# EAGLE design srfnec-pcb (EAGLE 6.5.0)
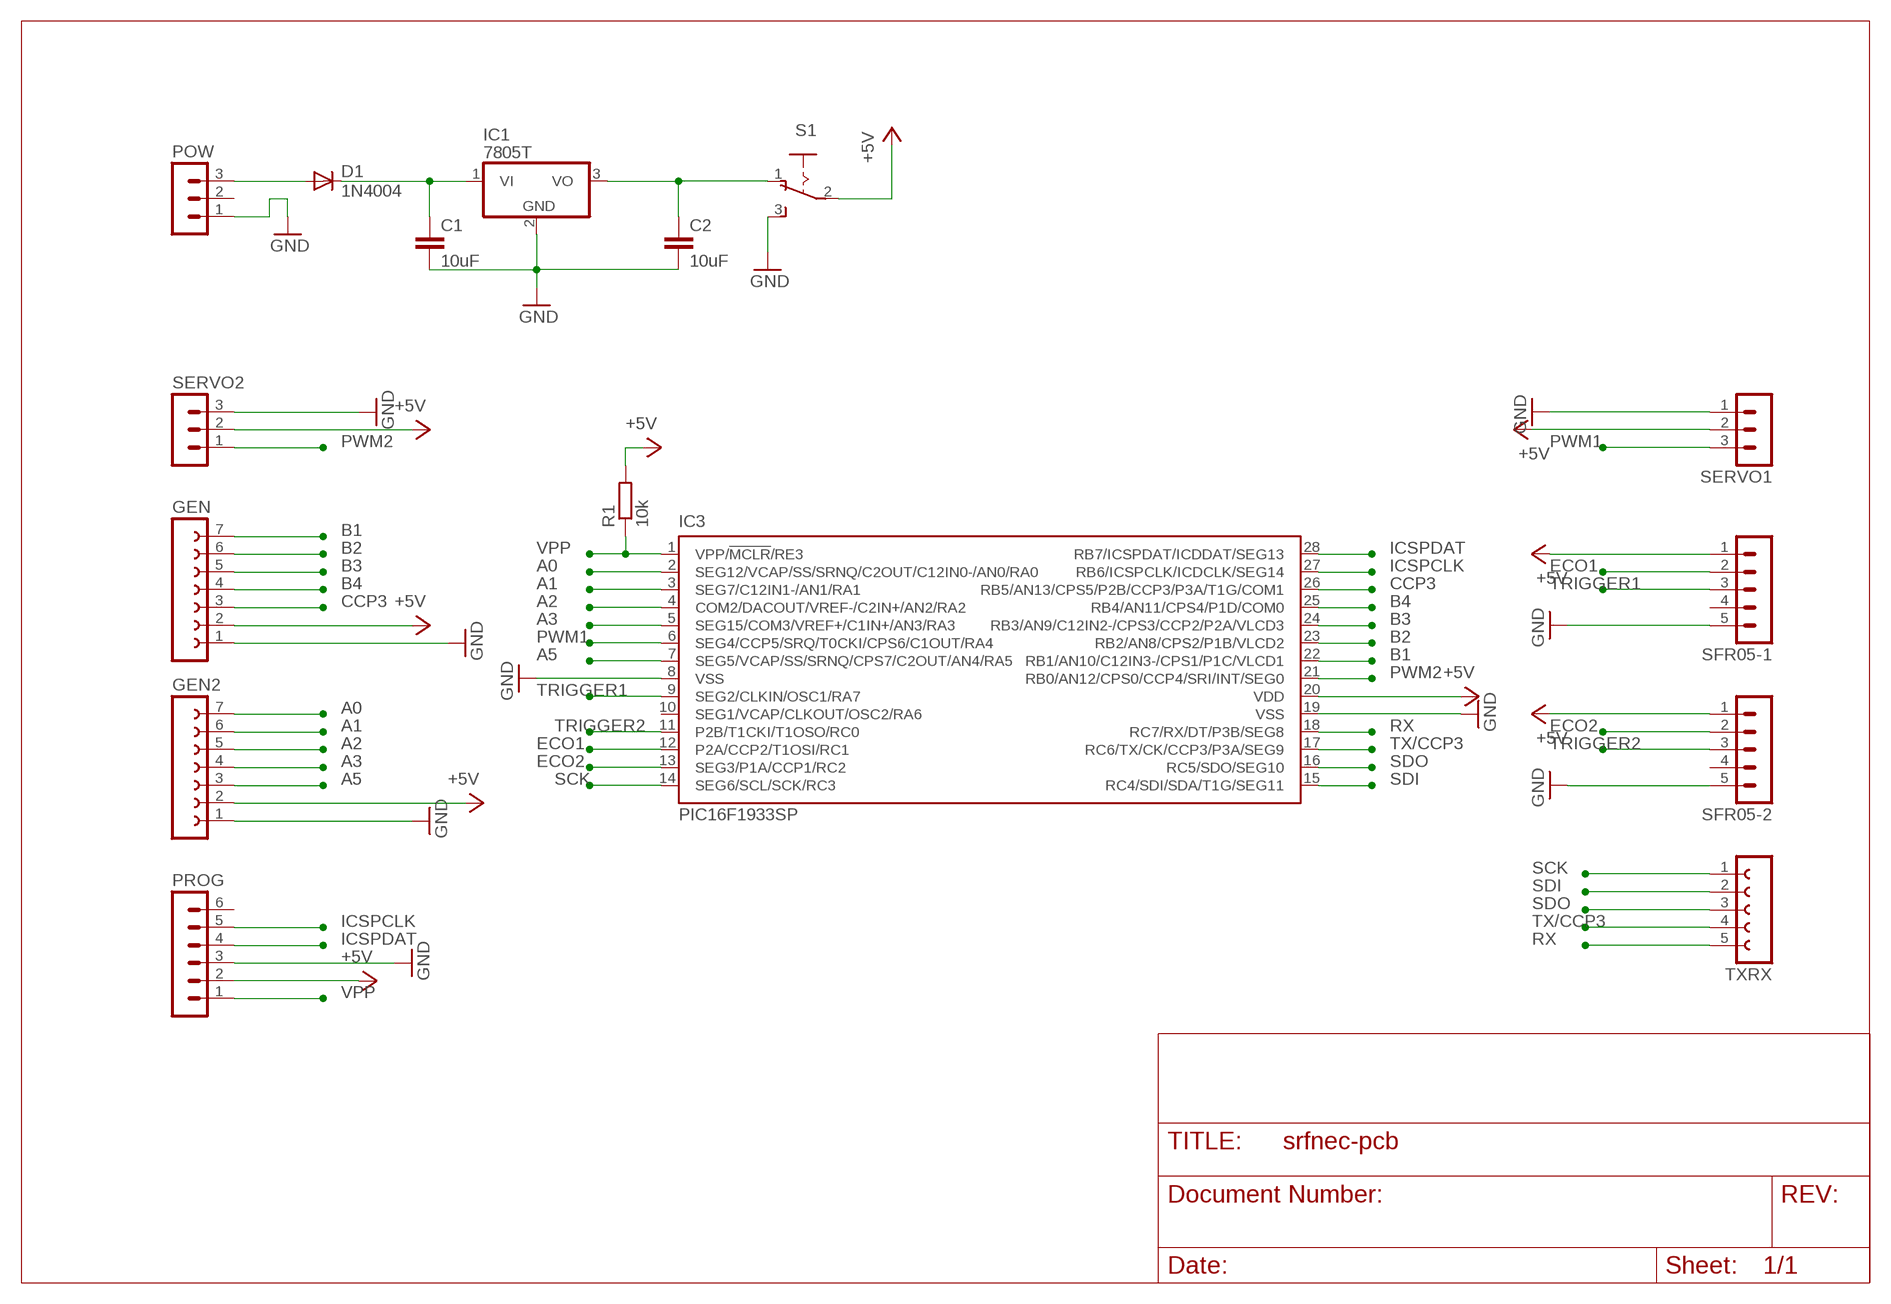
[diagram p0: schematic, sheet 1]

## Parts
C1  10uF  C5/2.5  [C5B2.5]
C2  10uF  C5/2.5  [C5B2.5]
D1  1N4004  [DO41-10]
GEN  FE07-1  [FE07]
GEN2  FE07-1  [FE07]
IC1  7805T  [TO220H]
IC3  PIC16F1933SP  [DIL28-3]
POW  MA03-1  [MA03-1]
PROG  MA06-1  [MA06-1]
R1  10k  R-EU_0204/7  [0204/7]
S1  255SB  [255SB]
SERVO1  MA03-1  [MA03-1]
SERVO2  MA03-1  [MA03-1]
SFR05-1  MA05-1  [MA05-1]
SFR05-2  MA05-1  [MA05-1]
TXRX  FE05-1  [FE05-1]

## Nets
+5V: GEN2.2 GEN.2 IC3.20(VDD) PROG.2 R1.2 S1.2(P) SERVO1.2 SERVO2.2 SFR05-1.1 SFR05-2.1
A0: GEN2.7 IC3.2(SEG12/VCAP/SS/SRNQ/C2OUT/C12IN0-/AN0/RA0)
A1: GEN2.6 IC3.3(SEG7/C12IN1-/AN1/RA1)
A2: GEN2.5 IC3.4(COM2/DACOUT/VREF-/C2IN+/AN2/RA2)
A3: GEN2.4 IC3.5(SEG15/COM3/VREF+/C1IN+/AN3/RA3)
A5: GEN2.3 IC3.7(SEG5/VCAP/SS/SRNQ/CPS7/C2OUT/AN4/RA5)
B1: GEN.7 IC3.22(RB1/AN10/C12IN3-/CPS1/P1C/VLCD1)
B2: GEN.6 IC3.23(RB2/AN8/CPS2/P1B/VLCD2)
B3: GEN.5 IC3.24(RB3/AN9/C12IN2-/CPS3/CCP2/P2A/VLCD3)
B4: GEN.4 IC3.25(RB4/AN11/CPS4/P1D/COM0)
CCP3: GEN.3 IC3.26(RB5/AN13/CPS5/P2B/CCP3/P3A/T1G/COM1)
ECO1: IC3.12(P2A/CCP2/T1OSI/RC1) SFR05-1.2
ECO2: IC3.13(SEG3/P1A/CCP1/RC2) SFR05-2.2
GND: C1.2 C2.2 GEN2.1 GEN.1 IC1.2(GND) IC3.8(VSS) IC3.19(VSS) POW.1 PROG.3 S1.3(S) SERVO1.1 SERVO2.3 SFR05-1.5 SFR05-2.5
ICSPCLK: IC3.27(RB6/ICSPCLK/ICDCLK/SEG14) PROG.5
ICSPDAT: IC3.28(RB7/ICSPDAT/ICDDAT/SEG13) PROG.4
N$1: C1.1 D1.C IC1.1(VI)
N$2: D1.A POW.3
N$3: C2.1 IC1.3(VO) S1.1(O)
PWM1: IC3.6(SEG4/CCP5/SRQ/T0CKI/CPS6/C1OUT/RA4) SERVO1.3
PWM2: IC3.21(RB0/AN12/CPS0/CCP4/SRI/INT/SEG0) SERVO2.1
RX: IC3.18(RC7/RX/DT/P3B/SEG8) TXRX.5
SCK: IC3.14(SEG6/SCL/SCK/RC3) TXRX.1
SDI: IC3.15(RC4/SDI/SDA/T1G/SEG11) TXRX.2
SDO: IC3.16(RC5/SDO/SEG10) TXRX.3
TRIGGER1: IC3.9(SEG2/CLKIN/OSC1/RA7) SFR05-1.3
TRIGGER2: IC3.11(P2B/T1CKI/T1OSO/RC0) SFR05-2.3
TX/CCP3: IC3.17(RC6/TX/CK/CCP3/P3A/SEG9) TXRX.4
VPP: IC3.1(VPP/!MCLR!/RE3) PROG.1 R1.1
Unconnected: IC3.10(SEG1/VCAP/CLKOUT/OSC2/RA6) POW.2 PROG.6 SFR05-1.4 SFR05-2.4

## Library data of the parts
C1 C2 = capacitor-wima:C: CAPACITOR naming: grid - package width
D1 = diode:1N4004: DIODE general purpose rectifier, 1 A
GEN GEN2 = con-lsta:FE07-1: FEMALE HEADER; OC_FARNELL: unknown; OC_NEWARK: unknown
IC1 = linear:78*: Positive VOLTAGE REGULATOR Source: http://cache.national.com/ds/LM/LM78L05.pdf http://www.fairchildsemi.com/ds/LM/LM7805.pdf
IC3 = microchip:PIC16F19*: Flash-Based, 8-Bit CMOS Microcontrollers wtih LCD Driver and nanoWatt XLP Technology Auto generated by make-symbol-device-package-bsdl.ulp Rev. 33 Source: http://ww1.microchip.com/downloads/en/DeviceDoc/41364D.pdf; MPN: PIC16F1933-I/SP; OC_FARNELL: 1755814; OC_NEWARK: 08R1938
POW SERVO1 SERVO2 = con-lstb:MA03-1: PIN HEADER; OC_FARNELL: unknown; OC_NEWARK: unknown
PROG = con-lstb:MA06-1: PIN HEADER; OC_FARNELL: unknown; OC_NEWARK: unknown
R1 = resistor:R-EU_: RESISTOR, European symbol
S1 = switch:255SB: SLIDING SWITCH Distributor Buerklin, 11G810
SFR05-1 SFR05-2 = con-lstb:MA05-1: PIN HEADER; OC_FARNELL: unknown; OC_NEWARK: unknown
TXRX = con-lsta:FE05-1: FEMALE HEADER; OC_FARNELL: unknown; OC_NEWARK: unknown

## Net classes
0 default: width 1.016 mm

## Board
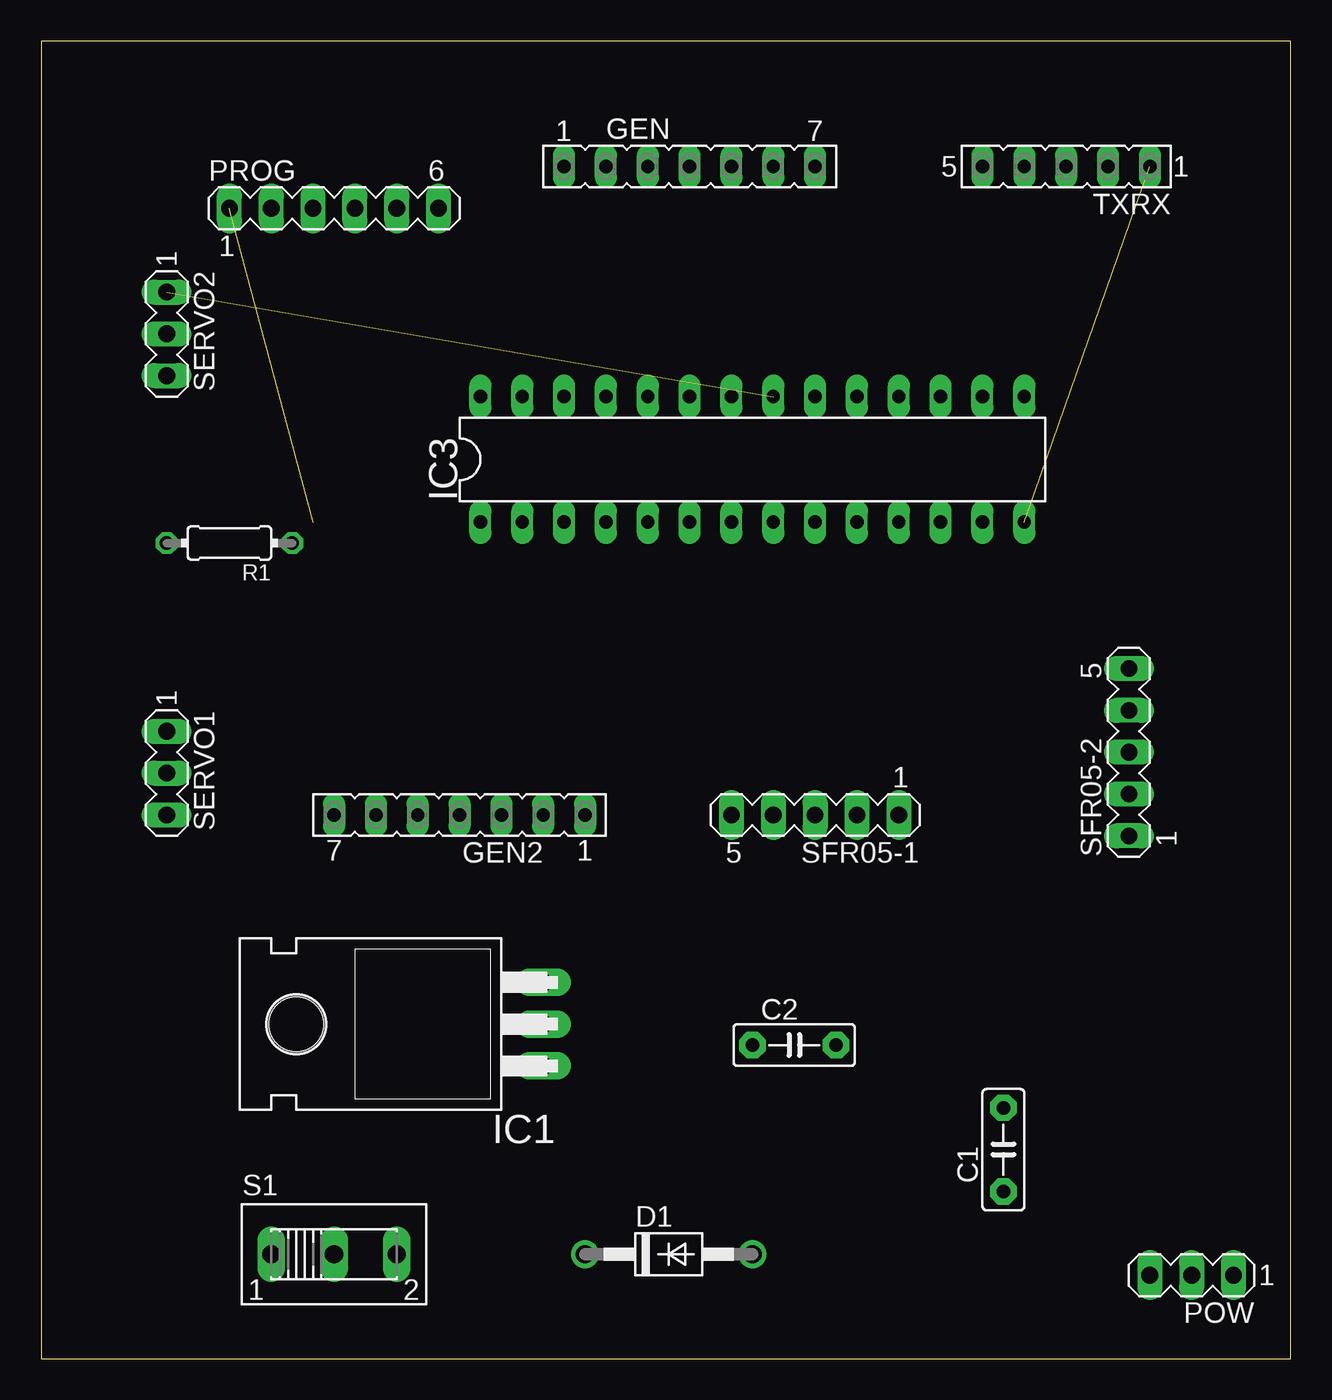
[diagram p1: board, top side]
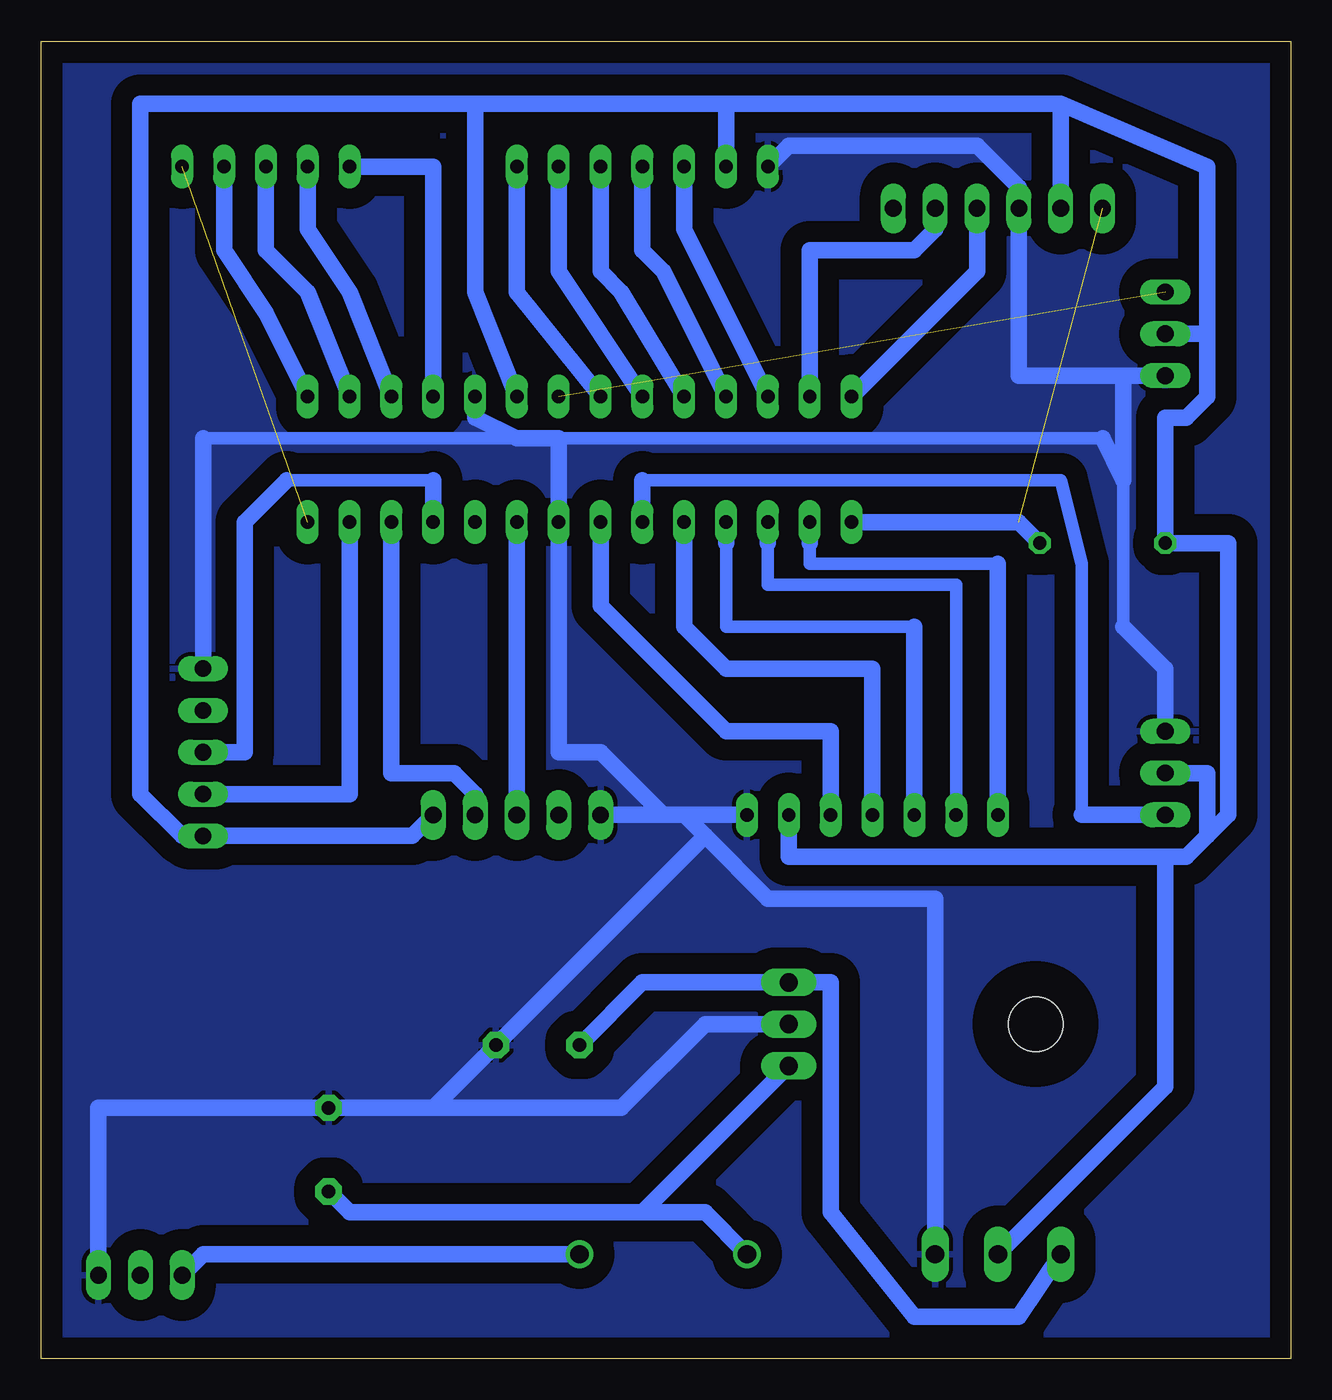
[diagram p2: board, bottom side, seen from below]

Size 75.87 x 80 mm. Coordinates in mm from the lower left corner, seen from the top.
Outline: 0,0 75.87,0 75.87,80 0,80 0,0
Copper layers (1*16): Top 0.035mm / dielectric 1.5mm / Bottom 0.035mm
Design rules "default": minimum track width 10mil, minimum drill 24mil, track to track 8mil, track to pad 8mil, pad to pad 8mil, via to via 8mil, smd to smd 8mil, copper to edge 40mil, drill to drill 8mil, minimum pad ring 10mil, minimum via ring 8mil, stop-mask expansion 4mil, vias tented up to drill 0mil, thermal gap 10mil

### Footprints (pad centres in the part's own frame; a part is rotated, then mirrored left to right if it is on the bottom)
C5B2.5 = drill 0.813 pad 1.6 octagon: 1 -2.54,0; 2 2.54,0
DO41-10 = drill 1.118: A 5.08,0; C -5.08,0
FE07 = drill 0.813 long: 1 -7.62,0; 2 -5.08,0; 3 -2.54,0; 4 0,0; 5 2.54,0; 6 5.08,0; 7 7.62,0
TO220H = drill 1.118 long: 1 -2.54,-10.16; 2 0,-10.16; 3 2.54,-10.16 | hole 3.302: 0,4.826
DIL28-3 = drill 0.813 long: 1 -16.51,-3.81; 2 -13.97,-3.81; 3 -11.43,-3.81; 4 -8.89,-3.81; 5 -6.35,-3.81; 6 -3.81,-3.81; 7 -1.27,-3.81; 8 1.27,-3.81; 9 3.81,-3.81; 10 6.35,-3.81; 11 8.89,-3.81; 12 11.43,-3.81; 13 13.97,-3.81; 14 16.51,-3.81; 15 16.51,3.81; 16 13.97,3.81; 17 11.43,3.81; 18 8.89,3.81; 19 6.35,3.81; 20 3.81,3.81; 21 1.27,3.81; 22 -1.27,3.81; 23 -3.81,3.81; 24 -6.35,3.81; 25 -8.89,3.81; 26 -11.43,3.81; 27 -13.97,3.81; 28 -16.51,3.81
MA03-1 = drill 1.016 long: 1 -2.54,0; 2 0,0; 3 2.54,0
MA06-1 = drill 1.016 long: 1 -6.35,0; 2 -3.81,0; 3 -1.27,0; 4 1.27,0; 5 3.81,0; 6 6.35,0
0204/7 = drill 0.813 octagon: 1 -3.81,0; 2 3.81,0
255SB = drill 1.118 long: 1 -3.81,0; 2 0,0; 3 3.81,0
MA05-1 = drill 1.016 long: 1 -5.08,0; 2 -2.54,0; 3 0,0; 4 2.54,0; 5 5.08,0
FE05-1 = drill 0.813 long: 1 -5.08,0; 2 -2.54,0; 3 0,0; 4 2.54,0; 5 5.08,0

### Placement (x,y rotation side)
C1  58.42,12.7 90 top
C2  45.72,19.05 0 top
D1  38.1,6.35 0 top
GEN  39.37,72.39 0 top
GEN2  25.4,33.02 180 top
IC1  20.32,20.32 90 top
IC3  43.18,54.61 0 top
POW  69.85,5.08 180 top
PROG  17.78,69.85 0 top
R1  11.43,49.53 180 top
S1  17.78,6.35 0 top
SERVO1  7.62,35.56 270 top
SERVO2  7.62,62.23 270 top
SFR05-1  46.99,33.02 180 top
SFR05-2  66.04,36.83 90 top
TXRX  62.23,72.39 180 top

### Tracks (layer width: path | path; a pad name or v marks a point on that pad's centre or on a via)
+5V
  Bottom 1.016: GEN2.2 30.48,30.48 7.62,30.48 | 7.62,30.48 6.35,30.48 5.08,31.75 | 5.08,31.75 5.08,35.56 SERVO1.2 | S1.2 7.62,16.51 7.62,30.48 | SFR05-1.1 53.34,31.75 SFR05-2.1 67.31,31.75 69.85,34.29 69.85,76.2 49.53,76.2 | 5.08,62.23 5.08,58.42 6.35,57.15 7.62,57.15 R1.2 3.81,49.53 3.81,33.02 5.08,31.75 | SERVO2.2 5.08,62.23 | 34.29,76.2 GEN.2 | 13.97,76.2 34.29,76.2 | PROG.2 13.97,76.2 | IC3.20 49.53,64.77 49.53,76.2 | 34.29,76.2 49.53,76.2 | 5.08,62.23 5.08,72.39 13.97,76.2
A0
  Bottom 0.762: 17.78,48.26 29.21,48.26 29.21,49.53
  Bottom 1.016: 17.78,48.26 GEN2.7 | IC3.2 29.21,49.53
A1
  Bottom 0.762: GEN2.6 20.32,46.99 31.75,46.99 31.75,49.53
  Bottom 1.016: IC3.3 31.75,49.53
A2
  Bottom 0.762: 22.86,44.45 34.29,44.45 34.29,49.53
  Bottom 1.016: 22.86,44.45 GEN2.5 | IC3.4 34.29,49.53
A3
  Bottom 1.016: GEN2.4 25.4,41.91 34.29,41.91 36.83,44.45 IC3.5
A5
  Bottom 1.016: GEN2.3 27.94,38.1 34.29,38.1 41.91,45.72 IC3.7
B1
  Bottom 1.016: IC3.22 46.99,64.77 GEN.7
B2
  Bottom 1.016: IC3.23 44.45,66.04 GEN.6
B3
  Bottom 1.016: IC3.24 40.64,64.77 41.91,66.04 GEN.5
B4
  Bottom 1.016: IC3.25 38.1,66.04 39.37,67.31 GEN.4
CCP3
  Bottom 1.016: IC3.26 36.83,68.58 GEN.3
ECO1
  Bottom 1.016: IC3.12 54.61,35.56 50.8,35.56 49.53,34.29 SFR05-1.2
ECO2
  Bottom 1.016: IC3.13 57.15,34.29 SFR05-2.2
GND
  Bottom 0.762: 10.16,53.34 10.16,44.45 | 46.99,55.88 66.04,55.88 | 44.45,55.88 11.43,55.88
  Bottom 1.016: GEN.1 30.48,73.66 19.05,73.66 16.51,71.12 PROG.3 16.51,59.69 10.16,59.69 | SERVO1.1 7.62,41.91 10.16,44.45 | 10.16,59.69 10.16,53.34 11.43,55.88 | SERVO2.3 10.16,59.69 | POW.1 72.39,15.24 C1.2 52.07,15.24 | 52.07,15.24 C2.2 35.56,31.75 | IC1.2 35.56,20.32 40.64,15.24 52.07,15.24 | IC3.19 49.53,57.15 46.99,55.88 44.45,55.88 IC3.8 44.45,36.83 41.91,36.83 38.1,33.02 | 66.04,55.88 SFR05-2.5 | SFR05-1.5 38.1,33.02 | 38.1,33.02 36.83,33.02 | 36.83,33.02 GEN2.1 | S1.3 21.59,27.94 31.75,27.94 35.56,31.75 | 36.83,33.02 35.56,31.75
  pour Bottom (isolate 1.27): 1.27,78.74 74.93,78.74 74.93,1.27 1.27,1.27
ICSPCLK
  Bottom 1.016: IC3.27 29.21,67.31 22.86,67.31 21.59,68.58 PROG.5
ICSPDAT
  Bottom 1.016: IC3.28 19.05,66.04 PROG.4
N$1
  Bottom 1.016: C1.1 57.15,8.89 39.37,8.89 | 39.37,8.89 35.56,8.89 D1.C | 39.37,8.89 IC1.1
N$2
  Bottom 1.016: POW.3 66.04,6.35 D1.A
N$3
  Bottom 1.016: C2.1 39.37,22.86 IC1.3 27.94,22.86 27.94,8.89 22.86,2.54 16.51,2.54 S1.1
PWM1
  Bottom 0.762: 39.37,53.34 13.97,53.34 12.7,48.26 12.7,33.02
  Bottom 1.016: 39.37,53.34 IC3.6 | SERVO1.3 12.7,33.02
PWM2  (1 unrouted)
RX
  Bottom 1.016: IC3.18 52.07,72.39 TXRX.5
SCK  (1 unrouted)
SDI
  Bottom 1.016: IC3.15 62.23,63.5 64.77,67.31 TXRX.2
SDO
  Bottom 1.016: IC3.16 59.69,64.77 62.23,67.31 TXRX.3
TRIGGER1
  Bottom 1.016: SFR05-1.3 IC3.9
TRIGGER2
  Bottom 0.762: 60.96,53.34 52.07,53.34
  Bottom 1.016: 52.07,53.34 IC3.11 | 60.96,53.34 63.5,50.8 63.5,36.83 SFR05-2.3
TX/CCP3
  Bottom 1.016: IC3.17 57.15,64.77 59.69,68.58 TXRX.4
VPP  (1 unrouted)
  Bottom 1.016: R1.1 16.51,50.8 IC3.1